# Altium schematic sheet audio.SchDoc: Audio frontend
size A4; Organization: GPA & FRYK Industries; DocumentNumber: 5; Revision: REV 0; SheetNumber: 5; SheetTotal: 6
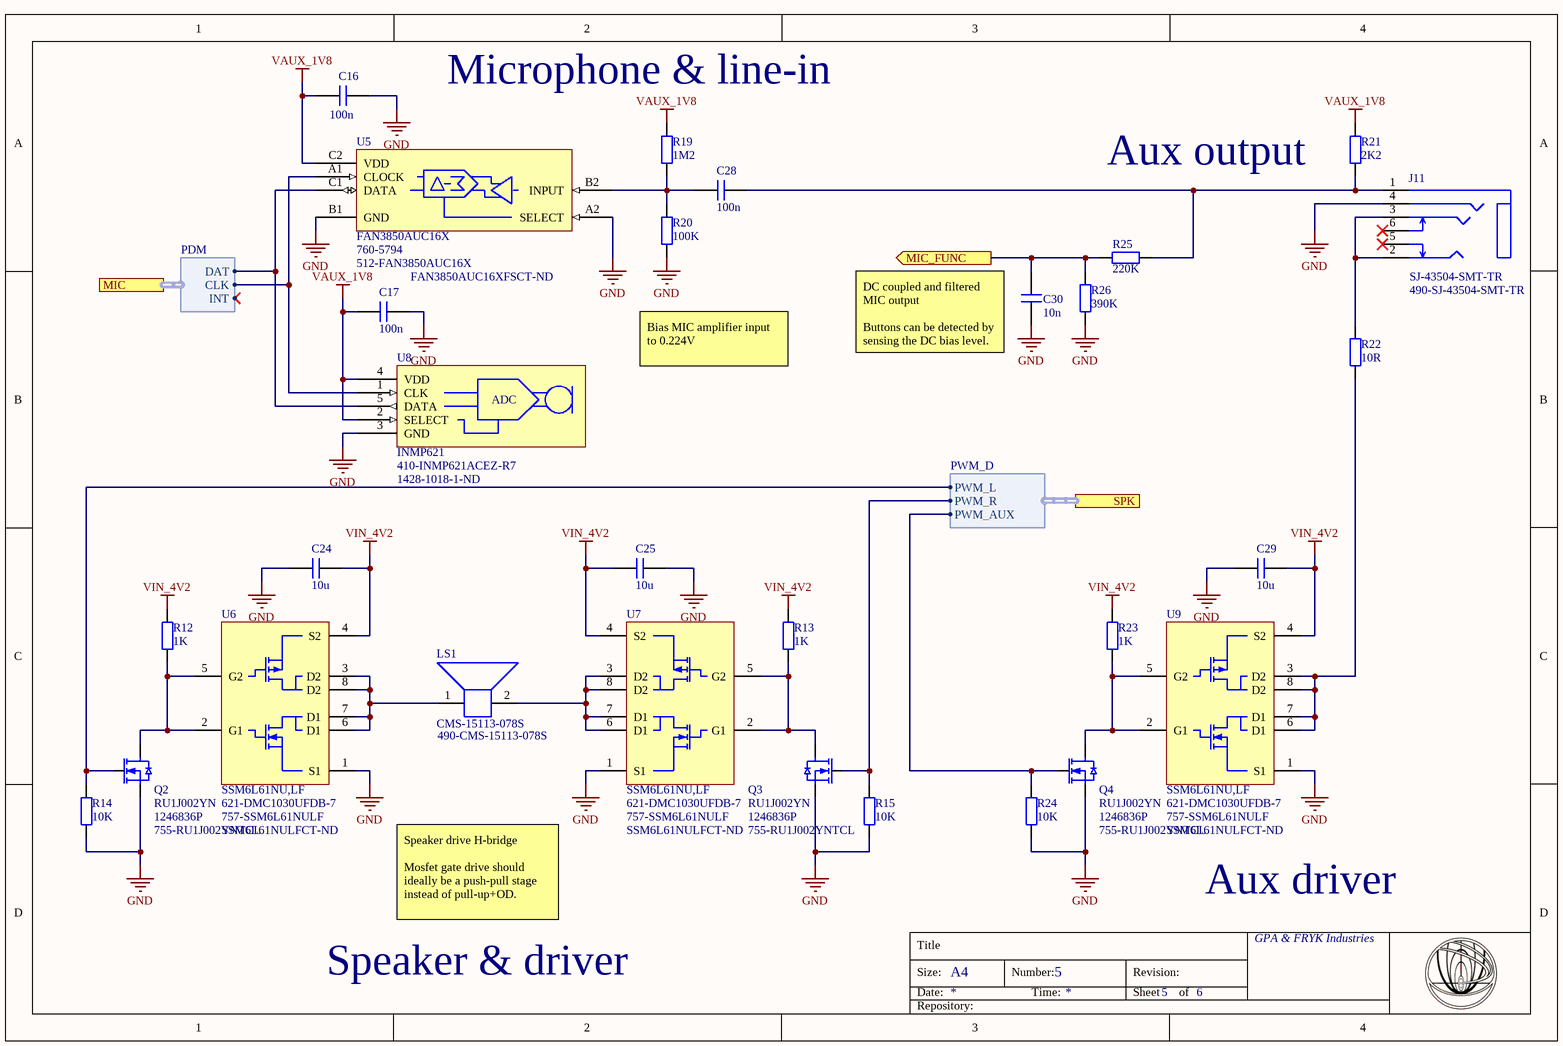
[diagram p0: audio.SchDoc]

## Parts
C16  value 100n  [CAPC1005X06N]  (hidden comment: cap)
C17  value 100n  [CAPC1005X06N]  (hidden comment: cap)
C24  value 10u  [CAPC3216X14N]  (hidden comment: cap)
C25  value 10u  [CAPC3216X14N]  (hidden comment: cap)
C28  value 100n  [CAPC1005X06N]  (hidden comment: cap)
C29  value 10u  [CAPC3216X14N]  (hidden comment: cap)
C30  value 10n  [CAPC1005X06N]  (hidden comment: cap)
J11  SJ-43504-SMT-TR  Supplier Part Number 1: 490-SJ-43504-SMT-TR  [SJ-43504-SMT-TR]
LS1  CMS-15113-078S  Supplier Part Number 1: 490-CMS-15113-078S  [cms-15113-078s]
Q2  RU1J002YN  Supplier Part Number 1: 1246836P  Supplier Part Number 2: 755-RU1J002YNTCL  [SOTFL65P210X105-3N]
Q3  RU1J002YN  Supplier Part Number 1: 1246836P  Supplier Part Number 2: 755-RU1J002YNTCL  [SOTFL65P210X105-3N]
Q4  RU1J002YN  Supplier Part Number 1: 1246836P  Supplier Part Number 2: 755-RU1J002YNTCL  [SOTFL65P210X105-3N]
R12  value 1K  [RESC1005X04N]  (hidden comment: res)
R13  value 1K  [RESC1005X04N]  (hidden comment: res)
R14  value 10K  [RESC1005X04N]  (hidden comment: res)
R15  value 10K  [RESC1005X04N]  (hidden comment: res)
R19  value 1M2  [RESC1005X04N]  (hidden comment: res)
R20  value 100K  [RESC1005X04N]  (hidden comment: res)
R21  value 2K2  [RESC1005X04N]  (hidden comment: res)
R22  value 10R  [RESC2012X06N]  (hidden comment: res)
R23  value 1K  [RESC1005X04N]  (hidden comment: res)
R24  value 10K  [RESC1005X04N]  (hidden comment: res)
R25  value 220K  [RESC1005X04N]  (hidden comment: res)
R26  value 390K  [RESC1005X04N]  (hidden comment: res)
U5  FAN3850AUC16X  Supplier Part Number 1: 760-5794  Supplier Part Number 2: 512-FAN3850AUC16X  Supplier Part Number 3: FAN3850AUC16XFSCT-ND  [BGA6C48P2X3_86X126X30]
U6  SSM6L61NU,LF  Supplier Part Number 1: 621-DMC1030UFDB-7  Supplier Part Number 2: 757-SSM6L61NULF  Supplier Part Number 3: SSM6L61NULFCT-ND  [SON65P200X80_HS-7N]
U7  SSM6L61NU,LF  Supplier Part Number 1: 621-DMC1030UFDB-7  Supplier Part Number 2: 757-SSM6L61NULF  Supplier Part Number 3: SSM6L61NULFCT-ND  [SON65P200X80_HS-7N]
U8  INMP621  Supplier Part Number 1: 410-INMP621ACEZ-R7  Supplier Part Number 2: 1428-1018-1-ND  [SON70P300X90-4N]
U9  SSM6L61NU,LF  Supplier Part Number 1: 621-DMC1030UFDB-7  Supplier Part Number 2: 757-SSM6L61NULF  Supplier Part Number 3: SSM6L61NULFCT-ND  [SON65P200X80_HS-7N]

## Ports
MIC (harness PDM), MIC_FUNC (out), SPK (harness PWM_D)

## Harnesses
PDM: DAT, CLK, INT
PWM_D: PWM_R, PWM_L, PWM_AUX

## Nets
GND: C16.1 C17.1 C24.2 C25.1 C29.1 C30.1 J11.4 Q2.2(S) Q3.2(S) Q4.2(S) R14.1 R15.1 R20.1 R24.1 R26.2 U5.A2(SELECT) U5.B1(GND) U6.1(S1) U7.1(S1) U8.3(GND) U9.1(S1)
VAUX_1V8: C16.2 C17.2 R19.2 R21.1 U5.C2(VDD) U8.2(SELECT) U8.4(VDD)
VIN_4V2: C24.1 C25.2 C29.2 R12.2 R13.2 R23.2 U6.4(S2) U7.4(S2) U9.4(S2)
MIC_FUNC: C30.2 R25.2 R26.1 ; port MIC_FUNC
NetC28_1: C28.1 R19.1 R20.2 U5.B2(INPUT)
NetC28_2: C28.2 J11.1 R21.2 R25.1
NetJ11_2: J11.2 J11.3 R22.2
NetLS1_1: LS1.1 U6.3(D2) U6.6(D1) U6.7(D1) U6.8(D2)
NetLS1_2: LS1.2 U7.3(D2) U7.6(D1) U7.7(D1) U7.8(D2)
NetQ2_1: Q2.1(G) R14.2 ; port SPK.PWM_L
NetQ2_3: Q2.3(D) R12.1 U6.2(G1) U6.5(G2)
NetQ3_1: Q3.1(G) R15.2 ; port SPK.PWM_R
NetQ3_3: Q3.3(D) R13.1 U7.2(G1) U7.5(G2)
NetQ4_1: Q4.1(G) R24.2 ; port SPK.PWM_AUX
NetQ4_3: Q4.3(D) R23.1 U9.2(G1) U9.5(G2)
NetR22_1: R22.1 U9.3(D2) U9.6(D1) U9.7(D1) U9.8(D2)
NetU5_A1: U5.A1(CLOCK) U8.1(CLK) ; port MIC.CLK
NetU5_C1: U5.C1(DATA) U8.5(DATA) ; port MIC.DAT

Not connected (* = marked no-connect by the designer): J11 5(4)* 6(4)*

## Notes on the sheet
- (near R19) Microphone & line-in
- (near R21) Aux output
- Bias MIC amplifier input to 0.224V
- (near C30) DC coupled and filtered MIC output
  Buttons can be detected by sensing the DC bias level.
- Speaker drive H-bridge
  Mosfet gate drive should ideally be a push-pull stage instead of pull-up+OD.
- Aux driver
- Speaker & driver
- Title
- Size:
- Date:
- A4
- Number:
- Time:
- Revision:
- Sheet
- of
- Repository:
- (in symbol inmp621) ADC

## Library data of the parts
C16 C17 C28 C30 = cap: Capacitor; type: X7R; voltage: *; #digikey: *; #mouser: *
  C16 C17 C28: Supplier 1: Mouser; Supplier Part Number 1: 81-GCM155R71H103KA5J
C24 C25 C29 = cap: Capacitor; type: X5R; voltage: *; #digikey: *; #mouser: *; Supplier 1: Mouser; Supplier Part Number 1: 810-C3216X5R1C106M
J11 = sj-43504-smt-tr: MID MOUNT AUDIO JACK; ComponentLink1Description: datasheet; ComponentLink1URL: https://www.mouser.se/datasheet/2/670/sj-43504-smt-1391171.pdf; Supplier 1: Mouser
LS1 = cms-15113-078s: Speakers & Transducers 0.7W 8ohm 700Hz 15x11mm SpringContct; ComponentLink1Description: datasheet; ComponentLink1URL: https://www.mouser.se/datasheet/2/670/cms-15113-078x-1315382.pdf; Supplier 1: Mouser
Q2-Q4 = ru1j002yn: N-channel 50V 200mA Small signal MOSFET; ComponentLink1Description: datasheet; ComponentLink1URL: https://www.mouser.se/datasheet/2/348/ru1j002yn-e-1018335.pdf; Supplier 1: RSComponents; Supplier 2: Mouser
R12-R15 R19-R26 = res: Resistor; power: *; voltage: *; #digikey: *; #mouser: *
U5 = fan3850auc16x: Microphone Pre-Amplifier with Digital Output; ComponentLink1Description: datasheet; ComponentLink1URL: https://www.mouser.se/datasheet/2/308/FAN3850A-1305296.pdf; #digikey: *; #mouser: *; Supplier 1: RSComponents; Supplier 2: Mouser; Supplier 3: Digi-Key
U6 U7 U9 = ssm6l61nulf: 2 MOSFET in one package. 1 NMOS and one PMOS.; ComponentLink1Description: datasheet; ComponentLink1URL: http://toshiba.semicon-storage.com/ap-en/product/mosfet/detail.SSM6L61NU.html; Supplier 1: Mouser; Supplier 2: Mouser; Supplier 3: Digi-Key
U8 = inmp621: Wide Dynamic Range Microphone with PDM Digital Output; ComponentLink1Description: datasheet; ComponentLink1URL: https://www.invensense.com/wp-content/uploads/2015/02/INMP621.pdf; Supplier 1: Mouser; Supplier 2: Digi-Key